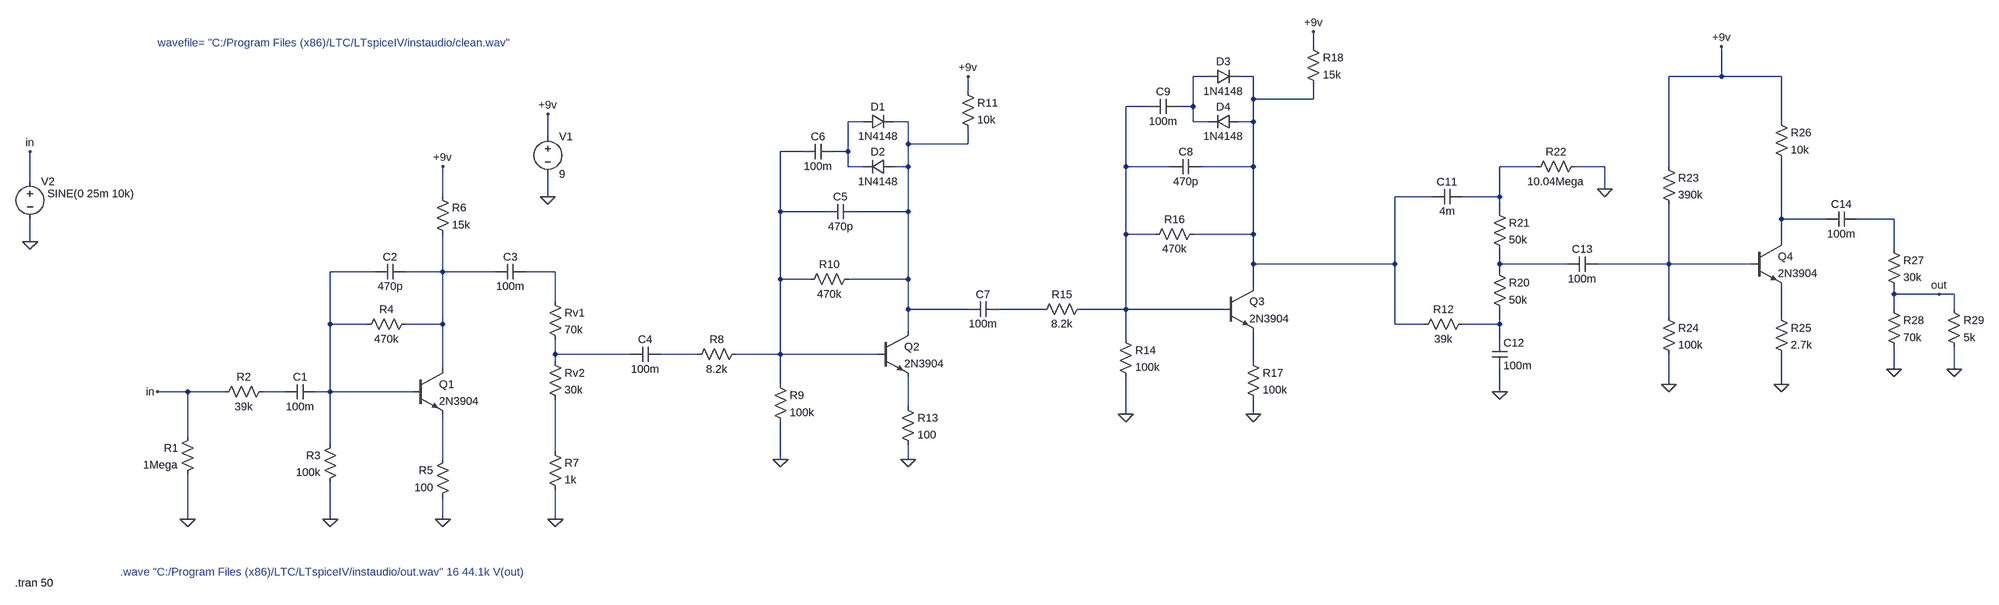
[diagram p0: schematic Big Muff Bass.asc]
Big Muff Bass.asc, the LTspice schematic file:
Version 4
SHEET 1 3640 840
WIRE 2032 -320 2032 -352
WIRE 1808 -256 1776 -256
WIRE 1904 -256 1872 -256
WIRE 3072 -256 3072 -320
WIRE 3072 -256 2960 -256
WIRE 3200 -256 3072 -256
WIRE 1296 -224 1296 -256
WIRE 1904 -208 1904 -256
WIRE 2032 -208 2032 -240
WIRE 2032 -208 1904 -208
WIRE 1680 -192 1632 -192
WIRE 1776 -192 1776 -256
WIRE 1776 -192 1744 -192
WIRE 1072 -160 1040 -160
WIRE 1168 -160 1136 -160
WIRE 1776 -160 1776 -192
WIRE 1808 -160 1776 -160
WIRE 1904 -160 1904 -208
WIRE 1904 -160 1872 -160
WIRE 3200 -160 3200 -256
WIRE 400 -128 400 -176
WIRE 1168 -112 1168 -160
WIRE 1296 -112 1296 -144
WIRE 1296 -112 1168 -112
WIRE 944 -96 896 -96
WIRE 1040 -96 1040 -160
WIRE 1040 -96 1008 -96
WIRE 1040 -64 1040 -96
WIRE 1072 -64 1040 -64
WIRE 1168 -64 1168 -112
WIRE 1168 -64 1136 -64
WIRE 1632 -64 1632 -192
WIRE 1728 -64 1632 -64
WIRE 1904 -64 1904 -160
WIRE 1904 -64 1792 -64
WIRE 2656 -64 2576 -64
WIRE 2800 -64 2736 -64
WIRE 2960 -64 2960 -256
WIRE -704 -32 -704 -96
WIRE 2800 -16 2800 -64
WIRE 176 0 176 -64
WIRE 400 0 400 -48
WIRE 2432 0 2352 0
WIRE 2576 0 2576 -64
WIRE 2576 0 2496 0
WIRE 896 32 896 -96
WIRE 992 32 896 32
WIRE 1168 32 1168 -64
WIRE 1168 32 1056 32
WIRE 2576 32 2576 0
WIRE 3200 48 3200 -80
WIRE 3296 48 3200 48
WIRE 3440 48 3360 48
WIRE 1632 80 1632 -64
WIRE 1696 80 1632 80
WIRE 1904 80 1904 -64
WIRE 1904 80 1776 80
WIRE -704 96 -704 48
WIRE 3200 96 3200 48
WIRE 3440 112 3440 48
WIRE 1904 144 1904 80
WIRE 2352 144 2352 0
WIRE 2352 144 1904 144
WIRE 2576 144 2576 112
WIRE 2720 144 2576 144
WIRE 2960 144 2960 16
WIRE 2960 144 2784 144
WIRE 3136 144 2960 144
WIRE 32 160 -64 160
WIRE 176 160 176 80
WIRE 176 160 96 160
WIRE 288 160 176 160
WIRE 416 160 352 160
WIRE 2576 160 2576 144
WIRE 896 176 896 32
WIRE 960 176 896 176
WIRE 1168 176 1168 32
WIRE 1168 176 1040 176
WIRE 1904 192 1904 144
WIRE 3440 208 3440 192
WIRE 3536 208 3440 208
WIRE 3568 208 3536 208
WIRE 416 224 416 160
WIRE 1168 240 1168 176
WIRE 1296 240 1168 240
WIRE 1456 240 1360 240
WIRE 1632 240 1632 80
WIRE 1632 240 1536 240
WIRE 1840 240 1632 240
WIRE 3440 240 3440 208
WIRE 3568 240 3568 208
WIRE 2960 256 2960 144
WIRE 3200 256 3200 192
WIRE -64 272 -64 160
WIRE 16 272 -64 272
WIRE 176 272 176 160
WIRE 176 272 96 272
WIRE 2352 272 2352 144
WIRE 2416 272 2352 272
WIRE 2576 272 2576 240
WIRE 2576 272 2496 272
WIRE 1168 288 1168 240
WIRE 1632 304 1632 240
WIRE 2576 304 2576 272
WIRE 416 336 416 304
WIRE 576 336 416 336
WIRE 720 336 640 336
WIRE 896 336 896 176
WIRE 896 336 800 336
WIRE 1104 336 896 336
WIRE 416 352 416 336
WIRE 1904 352 1904 288
WIRE 176 368 176 272
WIRE 3440 368 3440 320
WIRE 3568 368 3568 320
WIRE 896 400 896 336
WIRE 2960 400 2960 336
WIRE 3200 400 3200 336
WIRE -368 416 -432 416
WIRE -288 416 -368 416
WIRE -160 416 -208 416
WIRE -64 416 -64 272
WIRE -64 416 -96 416
WIRE 112 416 -64 416
WIRE 2576 416 2576 368
WIRE 1168 448 1168 384
WIRE 1632 464 1632 384
WIRE 1904 464 1904 432
WIRE -368 512 -368 416
WIRE -64 528 -64 416
WIRE 416 544 416 432
WIRE 176 560 176 464
WIRE 896 560 896 480
WIRE 1168 560 1168 528
WIRE -368 688 -368 592
WIRE -64 688 -64 608
WIRE 176 688 176 640
WIRE 416 688 416 624
FLAG 176 688 0
FLAG -64 688 0
FLAG -368 688 0
FLAG -432 416 in
FLAG 416 688 0
FLAG 896 560 0
FLAG 400 0 0
FLAG 400 -176 +9v
FLAG 176 -64 +9v
FLAG -704 96 0
FLAG -704 -96 in
FLAG 1168 560 0
FLAG 1296 -256 +9v
FLAG 1632 464 0
FLAG 1904 464 0
FLAG 2032 -352 +9v
FLAG 2800 -16 0
FLAG 2576 416 0
FLAG 3200 400 0
FLAG 2960 400 0
FLAG 3440 368 0
FLAG 3536 208 out
FLAG 3072 -320 +9v
FLAG 3568 368 0
SYMBOL npn 112 368 R0
SYMATTR InstName Q1
SYMATTR Value 2N3904
SYMBOL res -304 432 R270
WINDOW 0 32 56 VTop 2
WINDOW 3 0 56 VBottom 2
SYMATTR InstName R2
SYMATTR Value 39k
SYMBOL res -48 512 M0
SYMATTR InstName R3
SYMATTR Value 100k
SYMBOL res 0 288 R270
WINDOW 0 32 56 VTop 2
WINDOW 3 0 56 VBottom 2
SYMATTR InstName R4
SYMATTR Value 470k
SYMBOL res -352 496 M0
SYMATTR InstName R1
SYMATTR Value 1Mega
SYMBOL res 192 544 M0
SYMATTR InstName R5
SYMATTR Value 100
SYMBOL cap -160 432 R270
WINDOW 0 32 32 VTop 2
WINDOW 3 0 32 VBottom 2
SYMATTR InstName C1
SYMATTR Value 100m
SYMBOL cap 32 176 R270
WINDOW 0 32 32 VTop 2
WINDOW 3 0 32 VBottom 2
SYMATTR InstName C2
SYMATTR Value 470p
SYMBOL cap 288 176 R270
WINDOW 0 32 32 VTop 2
WINDOW 3 0 32 VBottom 2
SYMATTR InstName C3
SYMATTR Value 100m
SYMBOL res 400 208 R0
SYMATTR InstName Rv1
SYMATTR Value 70k
SYMBOL res 400 336 R0
SYMATTR InstName Rv2
SYMATTR Value 30k
SYMBOL res 400 528 R0
SYMATTR InstName R7
SYMATTR Value 1k
SYMBOL res 160 -16 R0
SYMATTR InstName R6
SYMATTR Value 15k
SYMBOL cap 576 352 R270
WINDOW 0 32 32 VTop 2
WINDOW 3 0 32 VBottom 2
SYMATTR InstName C4
SYMATTR Value 100m
SYMBOL res 880 384 R0
SYMATTR InstName R9
SYMATTR Value 100k
SYMBOL voltage 400 -144 R0
WINDOW 123 0 0 Left 2
WINDOW 39 0 0 Left 2
SYMATTR InstName V1
SYMATTR Value 9
SYMBOL voltage -704 -48 R0
WINDOW 3 37 42 Left 2
WINDOW 123 0 0 Left 2
WINDOW 39 0 0 Left 2
SYMATTR InstName V2
SYMATTR Value SINE(0 25m 10k)
SYMBOL res 704 352 R270
WINDOW 0 32 56 VTop 2
WINDOW 3 0 56 VBottom 2
SYMATTR InstName R8
SYMATTR Value 8.2k
SYMBOL res 944 192 R270
WINDOW 0 32 56 VTop 2
WINDOW 3 0 56 VBottom 2
SYMATTR InstName R10
SYMATTR Value 470k
SYMBOL npn 1104 288 R0
SYMATTR InstName Q2
SYMATTR Value 2N3904
SYMBOL res 1152 432 R0
SYMATTR InstName R13
SYMATTR Value 100
SYMBOL cap 992 48 R270
WINDOW 0 32 32 VTop 2
WINDOW 3 0 32 VBottom 2
SYMATTR InstName C5
SYMATTR Value 470p
SYMBOL cap 944 -80 R270
WINDOW 0 32 32 VTop 2
WINDOW 3 0 32 VBottom 2
SYMATTR InstName C6
SYMATTR Value 100m
SYMBOL diode 1072 -144 R270
WINDOW 0 32 32 VTop 2
WINDOW 3 0 32 VBottom 2
SYMATTR InstName D1
SYMATTR Value 1N4148
SYMBOL diode 1136 -80 R90
WINDOW 0 0 32 VBottom 2
WINDOW 3 32 32 VTop 2
SYMATTR InstName D2
SYMATTR Value 1N4148
SYMBOL res 1280 -240 R0
SYMATTR InstName R11
SYMATTR Value 10k
SYMBOL cap 1296 256 R270
WINDOW 0 32 32 VTop 2
WINDOW 3 0 32 VBottom 2
SYMATTR InstName C7
SYMATTR Value 100m
SYMBOL res 1616 288 R0
SYMATTR InstName R14
SYMATTR Value 100k
SYMBOL res 1440 256 R270
WINDOW 0 32 56 VTop 2
WINDOW 3 0 56 VBottom 2
SYMATTR InstName R15
SYMATTR Value 8.2k
SYMBOL res 1680 96 R270
WINDOW 0 32 56 VTop 2
WINDOW 3 0 56 VBottom 2
SYMATTR InstName R16
SYMATTR Value 470k
SYMBOL npn 1840 192 R0
SYMATTR InstName Q3
SYMATTR Value 2N3904
SYMBOL res 1888 336 R0
SYMATTR InstName R17
SYMATTR Value 100k
SYMBOL cap 1728 -48 R270
WINDOW 0 32 32 VTop 2
WINDOW 3 0 32 VBottom 2
SYMATTR InstName C8
SYMATTR Value 470p
SYMBOL cap 1680 -176 R270
WINDOW 0 32 32 VTop 2
WINDOW 3 0 32 VBottom 2
SYMATTR InstName C9
SYMATTR Value 100m
SYMBOL diode 1808 -240 R270
WINDOW 0 32 32 VTop 2
WINDOW 3 0 32 VBottom 2
SYMATTR InstName D3
SYMATTR Value 1N4148
SYMBOL diode 1872 -176 R90
WINDOW 0 0 32 VBottom 2
WINDOW 3 32 32 VTop 2
SYMATTR InstName D4
SYMATTR Value 1N4148
SYMBOL res 2016 -336 R0
SYMATTR InstName R18
SYMATTR Value 15k
SYMBOL cap 2432 16 R270
WINDOW 0 32 32 VTop 2
WINDOW 3 0 32 VBottom 2
SYMATTR InstName C11
SYMATTR Value 4m
SYMBOL res 2400 288 R270
WINDOW 0 32 56 VTop 2
WINDOW 3 0 56 VBottom 2
SYMATTR InstName R12
SYMATTR Value 39k
SYMBOL res 2560 144 R0
SYMATTR InstName R20
SYMATTR Value 50k
SYMBOL res 2560 16 R0
SYMATTR InstName R21
SYMATTR Value 50k
SYMBOL res 2640 -48 R270
WINDOW 0 32 56 VTop 2
WINDOW 3 0 56 VBottom 2
SYMATTR InstName R22
SYMATTR Value 10.04Mega
SYMBOL cap 2560 304 R0
SYMATTR InstName C12
SYMATTR Value 100m
SYMBOL cap 2720 160 R270
WINDOW 0 32 32 VTop 2
WINDOW 3 0 32 VBottom 2
SYMATTR InstName C13
SYMATTR Value 100m
SYMBOL res 2944 -80 R0
SYMATTR InstName R23
SYMATTR Value 390k
SYMBOL res 2944 240 R0
SYMATTR InstName R24
SYMATTR Value 100k
SYMBOL res 3184 240 R0
SYMATTR InstName R25
SYMATTR Value 2.7k
SYMBOL res 3184 -176 R0
SYMATTR InstName R26
SYMATTR Value 10k
SYMBOL npn 3136 96 R0
SYMATTR InstName Q4
SYMATTR Value 2N3904
SYMBOL cap 3296 64 R270
WINDOW 0 32 32 VTop 2
WINDOW 3 0 32 VBottom 2
SYMATTR InstName C14
SYMATTR Value 100m
SYMBOL res 3424 96 R0
SYMATTR InstName R27
SYMATTR Value 30k
SYMBOL res 3424 224 R0
SYMATTR InstName R28
SYMATTR Value 70k
SYMBOL res 3552 224 R0
SYMATTR InstName R29
SYMATTR Value 5k
TEXT -512 800 Left 2 ;.wave "C:/Program Files (x86)/LTC/LTspiceIV/instaudio/out.wav" 16 44.1k V(out)
TEXT -736 824 Left 2 !.tran 50
TEXT -432 -328 Left 2 ;wavefile= "C:/Program Files (x86)/LTC/LTspiceIV/instaudio/clean.wav"

The netlist it stands for:
* Big Muff Bass.asc
Q1 N013 N012 N024 0 2N3904
R2 in N021 39k
R3 N012 0 100k
R4 N012 N013 470k
R1 in 0 1Mega
R5 N024 0 100
C1 N021 N012 100m
C2 N012 N013 470p
C3 N013 N014 100m
Rv1 N014 N018 70k
Rv2 N018 N023 30k
R7 N023 0 1k
R6 +9v N013 15k
C4 N018 N019 100m
R9 N006 0 100k
V1 +9v 0 9
V2 in 0 SINE(0 25m 10k)
R8 N019 N006 8.2k
R10 N006 N005 470k
Q2 N005 N006 N022 0 2N3904
R13 N022 0 100
C5 N006 N005 470p
C6 N006 N004 100m
D1 N004 N005 1N4148
D2 N005 N004 1N4148
R11 +9v N005 10k
C7 N005 N015 100m
R14 N003 0 100k
R15 N015 N003 8.2k
R16 N003 N002 470k
Q3 N002 N003 N020 0 2N3904
R17 N020 0 100k
C8 N003 N002 470p
C9 N003 N001 100m
D3 N001 N002 1N4148
D4 N002 N001 1N4148
R18 +9v N002 15k
C11 N002 N007 4m
R12 N002 N017 39k
R20 N010 N017 50k
R21 N007 N010 50k
R22 N007 0 10.04Mega
C12 N017 0 100m
C13 N010 N011 100m
R23 +9v N011 390k
R24 N011 0 100k
R25 N016 0 2.7k
R26 +9v N008 10k
Q4 N008 N011 N016 0 2N3904
C14 N008 N009 100m
R27 N009 out 30k
R28 out 0 70k
R29 out 0 5k
.model D D
.lib standard.dio
.model NPN NPN
.model PNP PNP
.lib standard.bjt
* .wave "C:/Program Files (x86)/LTC/LTspiceIV/instaudio/out.wav" 16 44.1k V(out)
.tran 50
* wavefile= "C:/Program Files (x86)/LTC/LTspiceIV/instaudio/clean.wav"
.backanno
.end